# Altium project ECS.PrjPCB
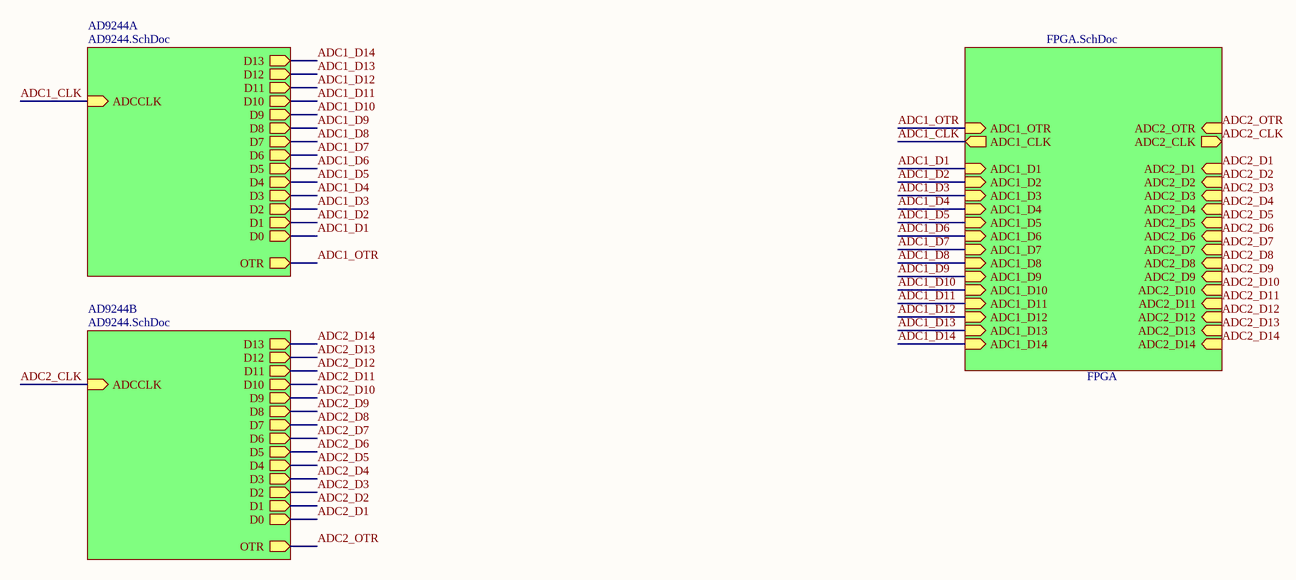
[diagram p0: ECS.SchDoc]
3 sheets, 237 parts. Net scope: hierarchical (ports join the sheet entries above them; power ports are global).
Board file: ECS.PcbDoc
Sheets:
  ECS.SchDoc
    FPGA = FPGA.SchDoc
    AD9244A = AD9244.SchDoc
    AD9244B = AD9244.SchDoc

## Sheet ECS.SchDoc
size A4

### Sub-sheets
AD9244A = AD9244.SchDoc: D13 (out), D12 (out), D11 (out), D10 (out), D9 (out), D8 (out), D7 (out), D6 (out), D4 (out), D5 (out), D3 (out), D2 (out), D1 (out), D0 (out), OTR (out), ADCCLK (in)
AD9244B = AD9244.SchDoc: D13 (out), D12 (out), D11 (out), D10 (out), D9 (out), D8 (out), D7 (out), D6 (out), D4 (out), D5 (out), D3 (out), D2 (out), D1 (out), D0 (out), OTR (out), ADCCLK (in)
FPGA = FPGA.SchDoc: ADC1_OTR (in), ADC1_D1 (in), ADC1_D2 (in), ADC1_D3 (in), ADC1_D4 (in), ADC1_D5 (in), ADC1_D6 (in), ADC1_D7 (in), ADC1_D8 (in), ADC1_D9 (in), ADC1_D10 (in), ADC1_D11 (in), ADC1_D12 (in), ADC1_D13 (in), ADC1_D14 (in), ADC1_CLK (out), ADC2_CLK (out), ADC2_OTR (in), ADC2_D1 (in), ADC2_D2 (in), ADC2_D3 (in), ADC2_D4 (in), ADC2_D5 (in), ADC2_D6 (in), ADC2_D7 (in), ADC2_D8 (in), ADC2_D9 (in), ADC2_D10 (in), ADC2_D11 (in), ADC2_D12 (in), ADC2_D13 (in), ADC2_D14 (in)

### Nets
ADC1_CLK: sheet FPGA/ADC1_CLK, sheet AD9244A/ADCCLK
ADC1_D1: sheet FPGA/ADC1_D1, sheet AD9244A/D0
ADC1_D2: sheet FPGA/ADC1_D2, sheet AD9244A/D1
ADC1_D3: sheet FPGA/ADC1_D3, sheet AD9244A/D2
ADC1_D4: sheet FPGA/ADC1_D4, sheet AD9244A/D3
ADC1_D5: sheet FPGA/ADC1_D5, sheet AD9244A/D4
ADC1_D6: sheet FPGA/ADC1_D6, sheet AD9244A/D5
ADC1_D7: sheet FPGA/ADC1_D7, sheet AD9244A/D6
ADC1_D8: sheet FPGA/ADC1_D8, sheet AD9244A/D7
ADC1_D9: sheet FPGA/ADC1_D9, sheet AD9244A/D8
ADC1_D10: sheet FPGA/ADC1_D10, sheet AD9244A/D9
ADC1_D11: sheet FPGA/ADC1_D11, sheet AD9244A/D10
ADC1_D12: sheet FPGA/ADC1_D12, sheet AD9244A/D11
ADC1_D13: sheet FPGA/ADC1_D13, sheet AD9244A/D12
ADC1_D14: sheet FPGA/ADC1_D14, sheet AD9244A/D13
ADC1_OTR: sheet FPGA/ADC1_OTR, sheet AD9244A/OTR
ADC2_CLK: sheet FPGA/ADC2_CLK, sheet AD9244B/ADCCLK
ADC2_D1: sheet FPGA/ADC2_D1, sheet AD9244B/D0
ADC2_D2: sheet FPGA/ADC2_D2, sheet AD9244B/D1
ADC2_D3: sheet FPGA/ADC2_D3, sheet AD9244B/D2
ADC2_D4: sheet FPGA/ADC2_D4, sheet AD9244B/D3
ADC2_D5: sheet FPGA/ADC2_D5, sheet AD9244B/D4
ADC2_D6: sheet FPGA/ADC2_D6, sheet AD9244B/D5
ADC2_D7: sheet FPGA/ADC2_D7, sheet AD9244B/D6
ADC2_D8: sheet FPGA/ADC2_D8, sheet AD9244B/D7
ADC2_D9: sheet FPGA/ADC2_D9, sheet AD9244B/D8
ADC2_D10: sheet FPGA/ADC2_D10, sheet AD9244B/D9
ADC2_D11: sheet FPGA/ADC2_D11, sheet AD9244B/D10
ADC2_D12: sheet FPGA/ADC2_D12, sheet AD9244B/D11
ADC2_D13: sheet FPGA/ADC2_D13, sheet AD9244B/D12
ADC2_D14: sheet FPGA/ADC2_D14, sheet AD9244B/D13
ADC2_OTR: sheet FPGA/ADC2_OTR, sheet AD9244B/OTR

## Sheet FPGA.SchDoc
size A2
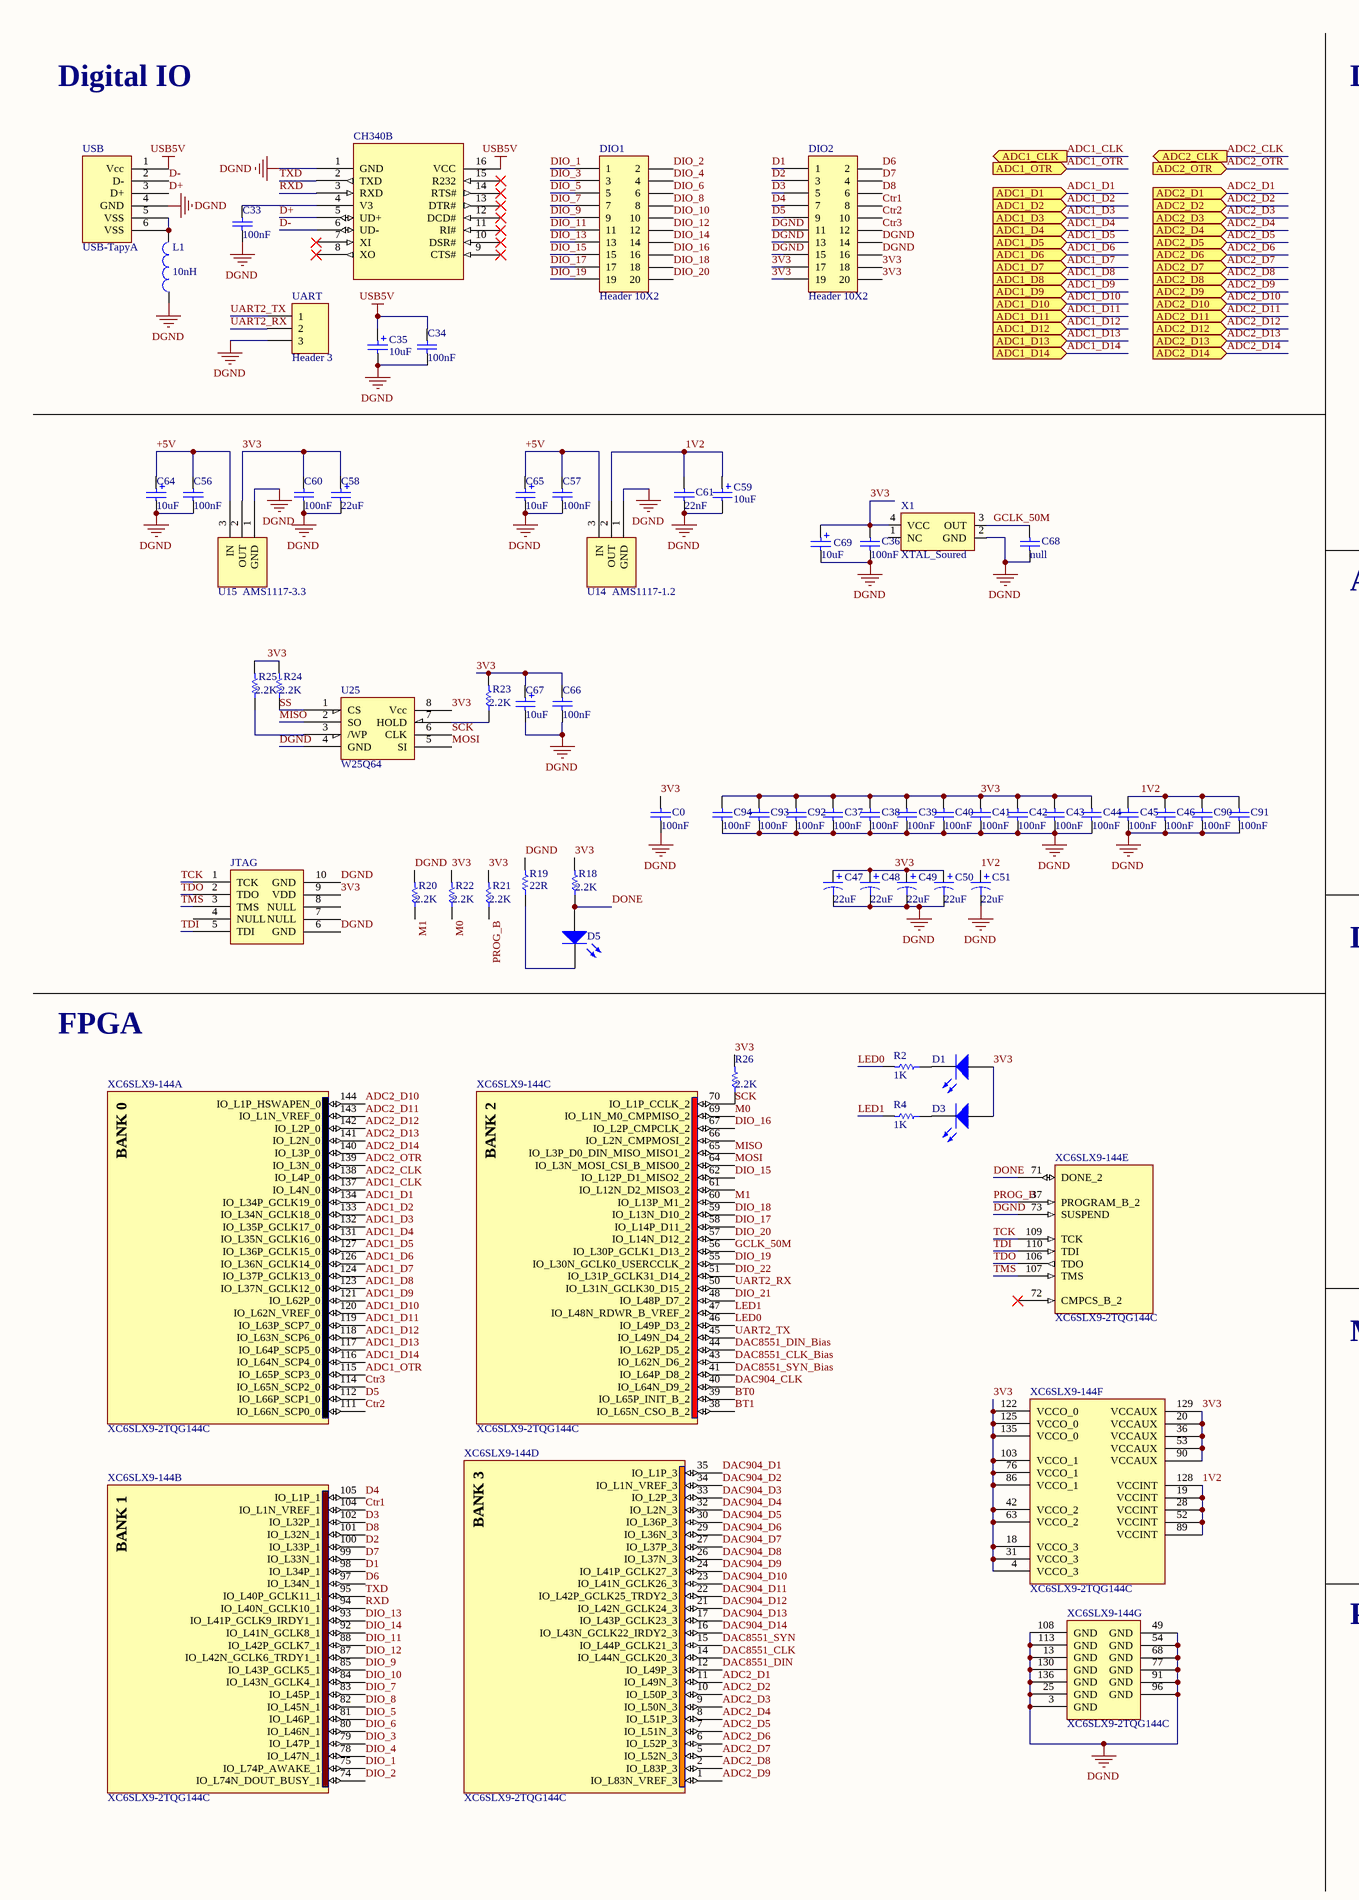
[diagram p1: FPGA.SchDoc, left]
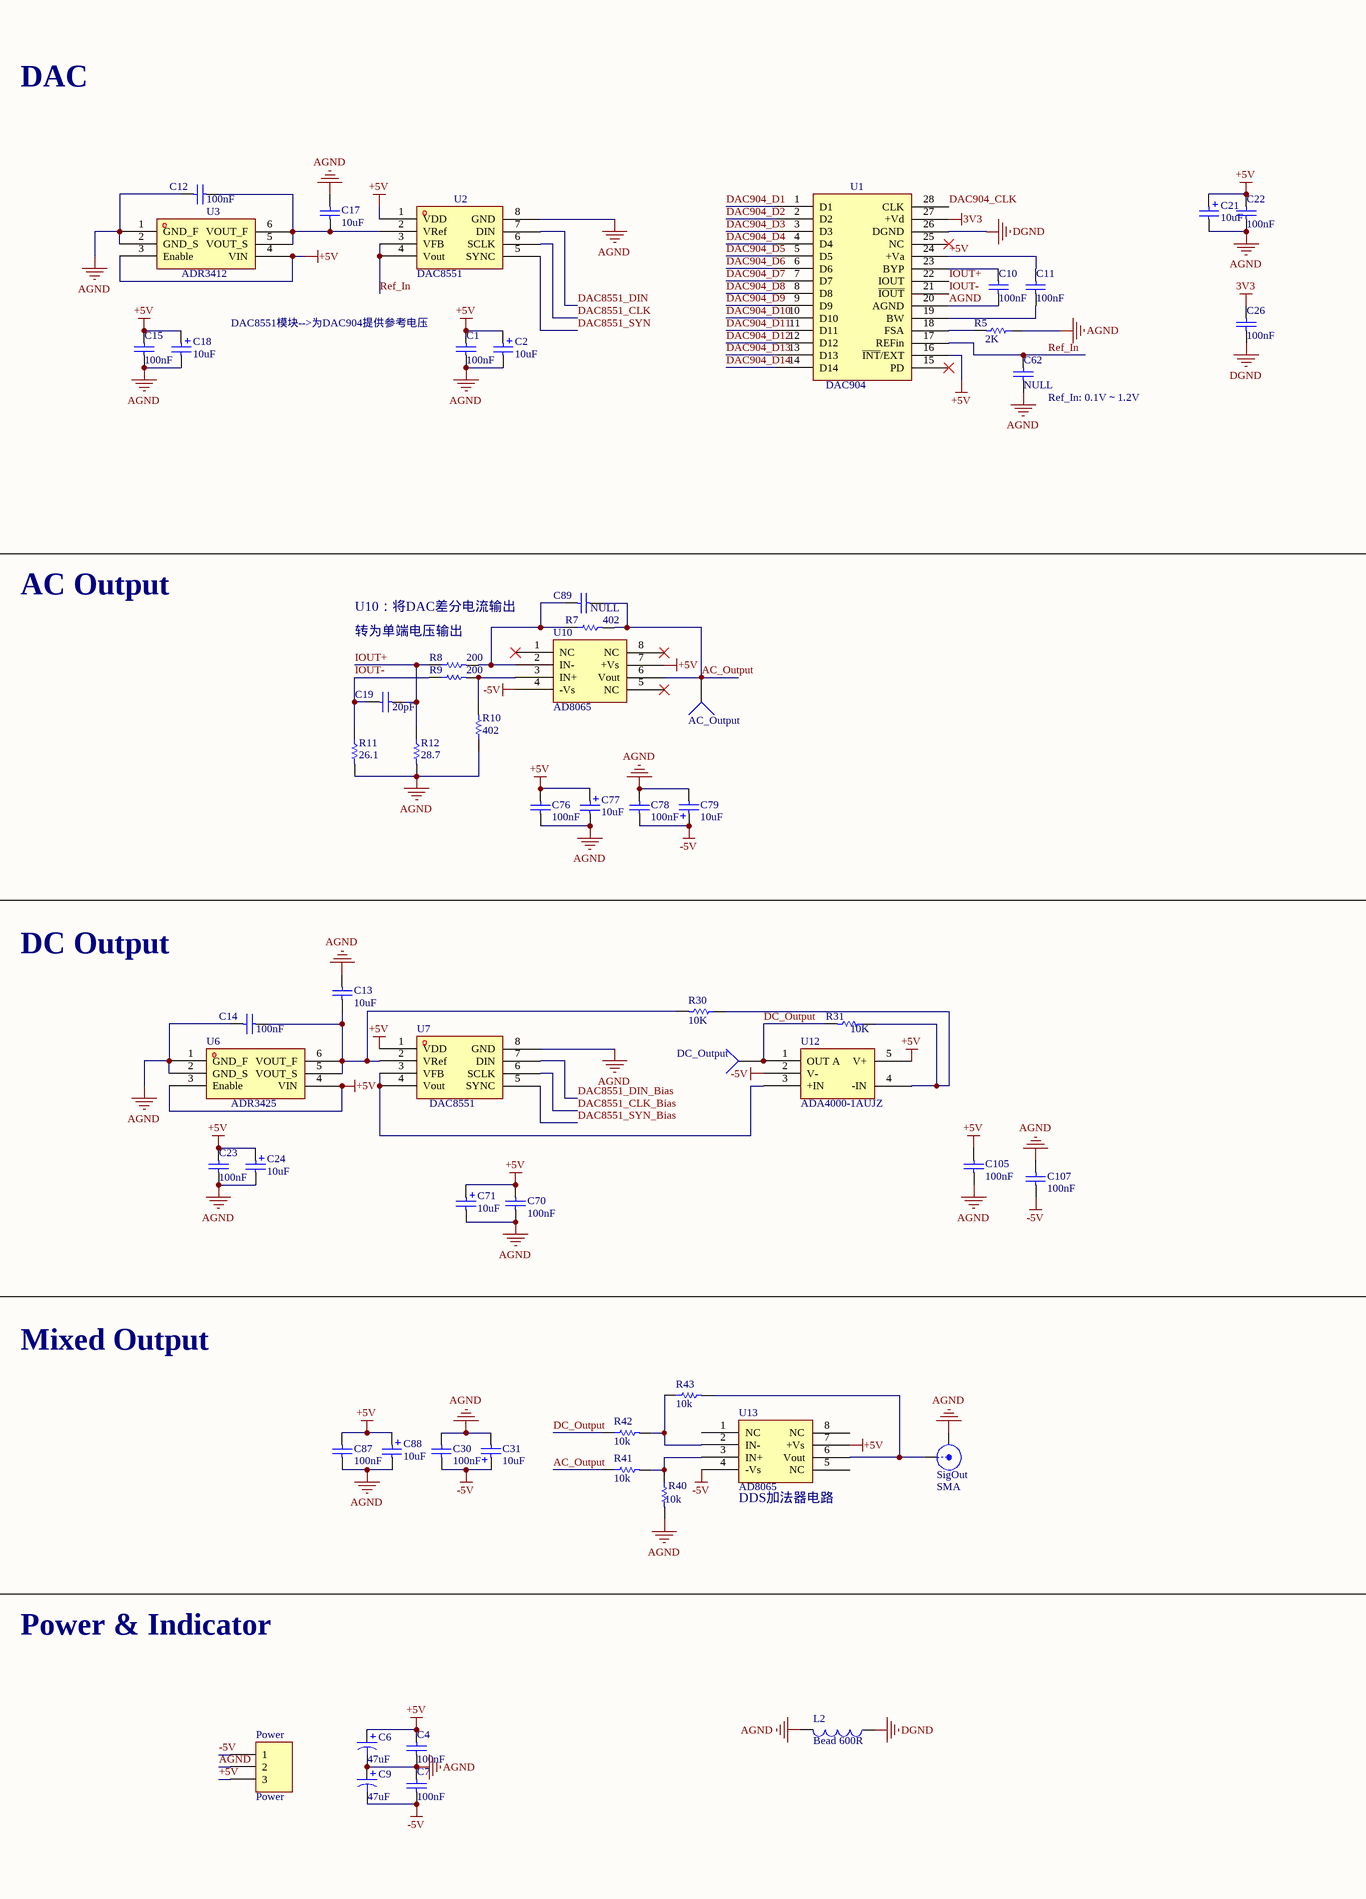
[diagram p2: FPGA.SchDoc, right]

### Parts
AC_Output  OutDir  [PIN1]  (value not drawn)
C0  100nF  [0603]
C1  100nF  [0603]
C2  10uF  [3216]
C4  100nF  [0603]
C6  47uF  [cap_pol_8*10.2]
C7  100nF  [0603]
C9  47uF  [cap_pol_8*10.2]
C10  100nF  [0603]
C11  100nF  [0603]
C12  100nF  [0603]
C13  10uF  [0805]
C14  100nF  [0603]
C15  100nF  [0603]
C17  value 10uF  [0805]  (hidden comment: 100nF)
C18  10uF  [3216]
C19  20pF  [0603]
C21  10uF  [3216]
C22  100nF  [0603]
C23  100nF  [0603]
C24  10uF  [3216]
C26  100nF  [0603]
C30  100nF  [0603]
C31  10uF  [3216]
C33  100nF  [0603]
C34  100nF  [0603]
C35  10uF  [3216]
C36  100nF  [0603]
C37  100nF  [0603]
C38  100nF  [0603]
C39  100nF  [0603]
C40  100nF  [0603]
C41  100nF  [0603]
C42  100nF  [0603]
C43  100nF  [0603]
C44  100nF  [0603]
C45  100nF  [0603]
C46  100nF  [0603]
C47  22uF  [3216]
C48  22uF  [3216]
C49  22uF  [3216]
C50  22uF  [3216]
C51  22uF  [3216]
C56  100nF  [0603]
C57  100nF  [0603]
C58  value 22uF  [3216]  (hidden comment: 10uF)
C59  10uF  [3216]
C60  100nF  [0603]
C61  22nF  [0603]
C62  value NULL  [0603]  (hidden comment: 100nF)
C64  10uF  [3216]
C65  10uF  [3216]
C66  100nF  [0603]
C67  10uF  [3216]
C68  value null  [0603]  (hidden comment: 100nF)
C69  10uF  [3216]
C70  100nF  [0603]
C71  10uF  [3216]
C76  100nF  [0603]
C77  10uF  [3216]
C78  100nF  [0603]
C79  10uF  [3216]
C87  100nF  [0603]
C88  10uF  [3216]
C89  NULL  [0603]
C90  100nF  [0603]
C91  100nF  [0603]
C92  100nF  [0603]
C93  100nF  [0603]
C94  100nF  [0603]
C105  100nF  [0603]
C107  100nF  [0603]
CH340B  Comment  [PCBComponent_1]  (value not drawn)
D1  LED3  [1206_LED]  (value not drawn)
D3  LED3  [1206_LED]  (value not drawn)
D5  LED3  [0805_pol1]  (value not drawn)
DC_Output  OutDir  [PIN1]  (value not drawn)
DIO1  Header 10X2  [HDR2X10]
DIO2  Header 10X2  [HDR2X10]
JTAG  JTAG 2*5p 2.00mm 180 degree  [JTAG_2.54_2x5]  (value not drawn)
L1  10nH  [0805]
L2  value Bead 600R  [0805]  (hidden comment: 10nH)
Power  Power  [PWR_3T]
R2  value 1K  [0603]  (hidden comment: 2.2K)
R4  value 1K  [0603]  (hidden comment: 2.2K)
R5  value 2K  [0603]  (hidden comment: 4.7K)
R7  402  [0603]
R8  200  [0603]
R9  200  [0603]
R10  402  [0603]
R11  26.1  [0603]
R12  28.7  [0603]
R18  2.2K  [0603]
R19  22R  [0603]
R20  2.2K  [0603]
R21  2.2K  [0603]
R22  2.2K  [0603]
R23  2.2K  [0603]
R24  2.2K  [0603]
R25  2.2K  [0603]
R26  2.2K  [0603]
R30  10K  [0603]
R31  10K  [0603]
R40  10k  [0603]
R41  10k  [0603]
R42  10k  [0603]
R43  10k  [0603]
SigOut  SMA  [SMA_SMT]
U1  DAC904  [TSSOP-28]
U2  DAC8551  [VSSOP-8]
U3  ADR3412  [SOT23-6]
U6  ADR3425  [SOT23-6]
U7  DAC8551  [VSSOP-8]
U10  AD8065  [SO-8N]
U12  ADA4000-1AUJZ  [SOT-23-5]
U13  AD8065  [SO-8N]
U14  AMS1117-1.2  [SOT-223]
U15  AMS1117-3.3  [SOT-223]
U25  W25Q64  [SO-8M]
UART  Header 3  [HDR1X3]
USB  USB-TapyA
X1  XTAL_Soured  [XTAL3225]
XC6SLX9-144  XC6SLX9-2TQG144C  [TQG144_N]  (parts A,B,C,D,E,F,G of 7)

### Ports
ADC1_CLK (out), ADC1_D1 (in), ADC1_D2 (in), ADC1_D3 (in), ADC1_D4 (in), ADC1_D5 (in), ADC1_D6 (in), ADC1_D7 (in), ADC1_D8 (in), ADC1_D9 (in), ADC1_D10 (in), ADC1_D11 (in), ADC1_D12 (in), ADC1_D13 (in), ADC1_D14 (in), ADC1_OTR (in), ADC2_CLK (out), ADC2_D1 (in), ADC2_D2 (in), ADC2_D3 (in), ADC2_D4 (in), ADC2_D5 (in), ADC2_D6 (in), ADC2_D7 (in), ADC2_D8 (in), ADC2_D9 (in), ADC2_D10 (in), ADC2_D11 (in), ADC2_D12 (in), ADC2_D13 (in), ADC2_D14 (in), ADC2_OTR (in)

### Nets
3V3: C0.2 C26.1 C36.2 C37.2 C38.2 C39.2 C40.2 C41.2 C42.2 C43.2 C44.2 C47.1 C48.1 C49.1 C50.1 C58.1 C60.2 C66.2 C67.1 C69.1 C92.2 C93.2 C94.2 D1.1(A) D3.1(A) DIO2.17 DIO2.18 DIO2.19 DIO2.20 JTAG.9(VDD) R18.2 R21.2 R22.2 R23.2 R24.2 R25.2 R26.2 U1.27(+Vd) U15.2(OUT) U25.8(Vcc) X1.4(VCC) XC6SLX9-144.4(VCCO_3) XC6SLX9-144.18(VCCO_3) XC6SLX9-144.20(VCCAUX) XC6SLX9-144.31(VCCO_3) XC6SLX9-144.36(VCCAUX) XC6SLX9-144.42(VCCO_2) XC6SLX9-144.53(VCCAUX) XC6SLX9-144.63(VCCO_2) XC6SLX9-144.76(VCCO_1) XC6SLX9-144.86(VCCO_1) XC6SLX9-144.90(VCCAUX) XC6SLX9-144.103(VCCO_1) XC6SLX9-144.122(VCCO_0) XC6SLX9-144.125(VCCO_0) XC6SLX9-144.129(VCCAUX) XC6SLX9-144.135(VCCO_0)
+5V: C1.2 C2.1 C4.1 C6.1 C11.1 C15.1 C18.1 C21.1 C22.1 C23.1 C24.1 C56.2 C57.2 C64.1 C65.1 C70.1 C71.1 C76.2 C77.1 C87.2 C88.1 C105.2 Power.3 U1.16(~{INT}/EXT) U1.24(+Va) U2.1(VDD) U3.3(Enable) U3.4(VIN) U6.3(Enable) U6.4(VIN) U7.1(VDD) U10.7(+Vs) U12.5(V+) U13.7(+Vs) U14.3(IN) U15.3(IN)
-5V: C7.2 C9.2 C30.1 C31.1 C78.1 C79.1 C107.1 Power.1 U10.4(-Vs) U12.2(V-) U13.4(-Vs)
AGND: C1.1 C2.2 C4.2 C6.2 C7.1 C9.1 C10.2 C12.1 C13.2 C14.1 C15.2 C17.2 C18.2 C21.2 C22.2 C23.2 C24.2 C30.2 C31.2 C62.2 C70.2 C71.2 C76.1 C77.2 C78.2 C79.2 C87.1 C88.2 C105.1 C107.2 L2.2 Power.2 R5.1 R10.1 R11.2 R12.2 R40.2 SigOut.2(Y) U1.20(AGND) U2.8(GND) U3.1(GND_F) U3.2(GND_S) U6.1(GND_F) U6.2(GND_S) U7.8(GND)
DGND: C0.1 C26.2 C33.2 C34.2 C35.2 C36.1 C37.1 C38.1 C39.1 C40.1 C41.1 C42.1 C43.1 C44.1 C45.1 C46.1 C47.2 C48.2 C49.2 C50.2 C51.2 C56.1 C57.1 C58.2 C59.2 C60.1 C61.1 C64.2 C65.2 C66.1 C67.2 C68.1 C69.2 C90.1 C91.1 C92.1 C93.1 C94.1 CH340B.1(GND) DIO2.11 DIO2.13 DIO2.14 DIO2.15 DIO2.16 JTAG.6(GND) JTAG.10(GND) L1.1 L2.1 R19.2 R20.2 U1.26(DGND) U14.1(GND) U15.1(GND) U25.4(GND) UART.3 USB.4(GND) X1.2(GND) XC6SLX9-144.3(GND) XC6SLX9-144.13(GND) XC6SLX9-144.25(GND) XC6SLX9-144.49(GND) XC6SLX9-144.54(GND) XC6SLX9-144.68(GND) XC6SLX9-144.73(SUSPEND) XC6SLX9-144.77(GND) XC6SLX9-144.91(GND) XC6SLX9-144.96(GND) XC6SLX9-144.108(GND) XC6SLX9-144.113(GND) XC6SLX9-144.130(GND) XC6SLX9-144.136(GND)
USB5V: C34.1 C35.1 CH340B.16(VCC) USB.1(Vcc)
1V2: C45.2 C46.2 C51.1 C59.1 C61.2 C90.2 C91.2 U14.2(OUT) XC6SLX9-144.19(VCCINT) XC6SLX9-144.28(VCCINT) XC6SLX9-144.52(VCCINT) XC6SLX9-144.89(VCCINT) XC6SLX9-144.128(VCCINT)
AC_Output: AC_Output.1 C89.2 R7.2 R41.1 U10.6(Vout)
ADC1_CLK: XC6SLX9-144.137(IO_L4N_0) ; port ADC1_CLK
ADC1_D1: XC6SLX9-144.134(IO_L34P_GCLK19_0) ; port ADC1_D1
ADC1_D2: XC6SLX9-144.133(IO_L34N_GCLK18_0) ; port ADC1_D2
ADC1_D3: XC6SLX9-144.132(IO_L35P_GCLK17_0) ; port ADC1_D3
ADC1_D4: XC6SLX9-144.131(IO_L35N_GCLK16_0) ; port ADC1_D4
ADC1_D5: XC6SLX9-144.127(IO_L36P_GCLK15_0) ; port ADC1_D5
ADC1_D6: XC6SLX9-144.126(IO_L36N_GCLK14_0) ; port ADC1_D6
ADC1_D7: XC6SLX9-144.124(IO_L37P_GCLK13_0) ; port ADC1_D7
ADC1_D8: XC6SLX9-144.123(IO_L37N_GCLK12_0) ; port ADC1_D8
ADC1_D9: XC6SLX9-144.121(IO_L62P_0) ; port ADC1_D9
ADC1_D10: XC6SLX9-144.120(IO_L62N_VREF_0) ; port ADC1_D10
ADC1_D11: XC6SLX9-144.119(IO_L63P_SCP7_0) ; port ADC1_D11
ADC1_D12: XC6SLX9-144.118(IO_L63N_SCP6_0) ; port ADC1_D12
ADC1_D13: XC6SLX9-144.117(IO_L64P_SCP5_0) ; port ADC1_D13
ADC1_D14: XC6SLX9-144.116(IO_L64N_SCP4_0) ; port ADC1_D14
ADC1_OTR: XC6SLX9-144.115(IO_L65P_SCP3_0) ; port ADC1_OTR
ADC2_CLK: XC6SLX9-144.138(IO_L4P_0) ; port ADC2_CLK
ADC2_D1: XC6SLX9-144.11(IO_L49N_3) ; port ADC2_D1
ADC2_D2: XC6SLX9-144.10(IO_L50P_3) ; port ADC2_D2
ADC2_D3: XC6SLX9-144.9(IO_L50N_3) ; port ADC2_D3
ADC2_D4: XC6SLX9-144.8(IO_L51P_3) ; port ADC2_D4
ADC2_D5: XC6SLX9-144.7(IO_L51N_3) ; port ADC2_D5
ADC2_D6: XC6SLX9-144.6(IO_L52P_3) ; port ADC2_D6
ADC2_D7: XC6SLX9-144.5(IO_L52N_3) ; port ADC2_D7
ADC2_D8: XC6SLX9-144.2(IO_L83P_3) ; port ADC2_D8
ADC2_D9: XC6SLX9-144.1(IO_L83N_VREF_3) ; port ADC2_D9
ADC2_D10: XC6SLX9-144.144(IO_L1P_HSWAPEN_0) ; port ADC2_D10
ADC2_D11: XC6SLX9-144.143(IO_L1N_VREF_0) ; port ADC2_D11
ADC2_D12: XC6SLX9-144.142(IO_L2P_0) ; port ADC2_D12
ADC2_D13: XC6SLX9-144.141(IO_L2N_0) ; port ADC2_D13
ADC2_D14: XC6SLX9-144.140(IO_L3P_0) ; port ADC2_D14
ADC2_OTR: XC6SLX9-144.139(IO_L3N_0) ; port ADC2_OTR
BT0: XC6SLX9-144.39(IO_L65P_INIT_B_2)
BT1: XC6SLX9-144.38(IO_L65N_CSO_B_2)
Ctr1: DIO2.8 XC6SLX9-144.104(IO_L1N_VREF_1)
Ctr2: DIO2.10 XC6SLX9-144.111(IO_L66N_SCP0_0)
Ctr3: DIO2.12 XC6SLX9-144.114(IO_L65N_SCP2_0)
D1: DIO2.1 XC6SLX9-144.98(IO_L34P_1)
D2: DIO2.3 XC6SLX9-144.100(IO_L33P_1)
D3: DIO2.5 XC6SLX9-144.102(IO_L32P_1)
D4: DIO2.7 XC6SLX9-144.105(IO_L1P_1)
D5: DIO2.9 XC6SLX9-144.112(IO_L66P_SCP1_0)
D6: DIO2.2 XC6SLX9-144.97(IO_L34N_1)
D7: DIO2.4 XC6SLX9-144.99(IO_L33N_1)
D8: DIO2.6 XC6SLX9-144.101(IO_L32N_1)
D+: CH340B.5(UD+) USB.3(D+)
D-: CH340B.6(UD-) USB.2(D-)
DAC904_CLK: U1.28(CLK) XC6SLX9-144.40(IO_L64N_D9_2)
DAC904_D1: U1.1(D1) XC6SLX9-144.35(IO_L1P_3)
DAC904_D2: U1.2(D2) XC6SLX9-144.34(IO_L1N_VREF_3)
DAC904_D3: U1.3(D3) XC6SLX9-144.33(IO_L2P_3)
DAC904_D4: U1.4(D4) XC6SLX9-144.32(IO_L2N_3)
DAC904_D5: U1.5(D5) XC6SLX9-144.30(IO_L36P_3)
DAC904_D6: U1.6(D6) XC6SLX9-144.29(IO_L36N_3)
DAC904_D7: U1.7(D7) XC6SLX9-144.27(IO_L37P_3)
DAC904_D8: U1.8(D8) XC6SLX9-144.26(IO_L37N_3)
DAC904_D9: U1.9(D9) XC6SLX9-144.24(IO_L41P_GCLK27_3)
DAC904_D10: U1.10(D10) XC6SLX9-144.23(IO_L41N_GCLK26_3)
DAC904_D11: U1.11(D11) XC6SLX9-144.22(IO_L42P_GCLK25_TRDY2_3)
DAC904_D12: U1.12(D12) XC6SLX9-144.21(IO_L42N_GCLK24_3)
DAC904_D13: U1.13(D13) XC6SLX9-144.17(IO_L43P_GCLK23_3)
DAC904_D14: U1.14(D14) XC6SLX9-144.16(IO_L43N_GCLK22_IRDY2_3)
DAC8551_CLK: U2.6(SCLK) XC6SLX9-144.14(IO_L44N_GCLK20_3)
DAC8551_CLK_Bias: U7.6(SCLK) XC6SLX9-144.43(IO_L62N_D6_2)
DAC8551_DIN: U2.7(DIN) XC6SLX9-144.12(IO_L49P_3)
DAC8551_DIN_Bias: U7.7(DIN) XC6SLX9-144.44(IO_L62P_D5_2)
DAC8551_SYN: U2.5(SYNC) XC6SLX9-144.15(IO_L44P_GCLK21_3)
DAC8551_SYN_Bias: U7.5(SYNC) XC6SLX9-144.41(IO_L64P_D8_2)
DC_Output: DC_Output.1 R31.2 R42.1 U12.1(OUT_A)
DIO_1: DIO1.1 XC6SLX9-144.75(IO_L74P_AWAKE_1)
DIO_2: DIO1.2 XC6SLX9-144.74(IO_L74N_DOUT_BUSY_1)
DIO_3: DIO1.3 XC6SLX9-144.79(IO_L47P_1)
DIO_4: DIO1.4 XC6SLX9-144.78(IO_L47N_1)
DIO_5: DIO1.5 XC6SLX9-144.81(IO_L46P_1)
DIO_6: DIO1.6 XC6SLX9-144.80(IO_L46N_1)
DIO_7: DIO1.7 XC6SLX9-144.83(IO_L45P_1)
DIO_8: DIO1.8 XC6SLX9-144.82(IO_L45N_1)
DIO_9: DIO1.9 XC6SLX9-144.85(IO_L43P_GCLK5_1)
DIO_10: DIO1.10 XC6SLX9-144.84(IO_L43N_GCLK4_1)
DIO_11: DIO1.11 XC6SLX9-144.88(IO_L42P_GCLK7_1)
DIO_12: DIO1.12 XC6SLX9-144.87(IO_L42N_GCLK6_TRDY1_1)
DIO_13: DIO1.13 XC6SLX9-144.93(IO_L41P_GCLK9_IRDY1_1)
DIO_14: DIO1.14 XC6SLX9-144.92(IO_L41N_GCLK8_1)
DIO_15: DIO1.15 XC6SLX9-144.62(IO_L12P_D1_MISO2_2)
DIO_16: DIO1.16 XC6SLX9-144.67(IO_L2P_CMPCLK_2)
DIO_17: DIO1.17 XC6SLX9-144.58(IO_L14P_D11_2)
DIO_18: DIO1.18 XC6SLX9-144.59(IO_L13N_D10_2)
DIO_19: DIO1.19 XC6SLX9-144.55(IO_L30N_GCLK0_USERCCLK_2)
DIO_20: DIO1.20 XC6SLX9-144.57(IO_L14N_D12_2)
DIO_21: XC6SLX9-144.48(IO_L48P_D7_2)
DIO_22: XC6SLX9-144.51(IO_L31P_GCLK31_D14_2)
DONE: D5.1(A) R18.1 XC6SLX9-144.71(DONE_2)
GCLK_50M: C68.2 X1.3(OUT) XC6SLX9-144.56(IO_L30P_GCLK1_D13_2)
IOUT+: C19.2 R8.1 R12.1 U1.22(IOUT)
IOUT-: C19.1 R9.1 R11.1 U1.21(~{IOUT})
LED0: R2.2 XC6SLX9-144.46(IO_L49P_D3_2)
LED1: R4.2 XC6SLX9-144.47(IO_L48N_RDWR_B_VREF_2)
M0: R22.1 XC6SLX9-144.69(IO_L1N_M0_CMPMISO_2)
M1: R20.1 XC6SLX9-144.60(IO_L13P_M1_2)
MISO: U25.2(SO) XC6SLX9-144.65(IO_L3P_D0_DIN_MISO_MISO1_2)
MOSI: U25.5(SI) XC6SLX9-144.64(IO_L3N_MOSI_CSI_B_MISO0_2)
PROG_B: R21.1 XC6SLX9-144.37(PROGRAM_B_2)
Ref_In: C62.1 U1.17(REFin) U2.3(VFB) U2.4(Vout)
RXD: CH340B.3(RXD) XC6SLX9-144.94(IO_L40N_GCLK10_1)
SCK: R26.1 U25.6(CLK) XC6SLX9-144.70(IO_L1P_CCLK_2)
SS: R24.1 U25.1(CS)
TCK: JTAG.1(TCK) XC6SLX9-144.109(TCK)
TDI: JTAG.5(TDI) XC6SLX9-144.110(TDI)
TDO: JTAG.2(TDO) XC6SLX9-144.106(TDO)
TMS: JTAG.3(TMS) XC6SLX9-144.107(TMS)
TXD: CH340B.2(TXD) XC6SLX9-144.95(IO_L40P_GCLK11_1)
UART2_RX: UART.2 XC6SLX9-144.50(IO_L31N_GCLK30_D15_2)
UART2_TX: UART.1 XC6SLX9-144.45(IO_L49N_D4_2)
NetC10_1: C10.1 U1.23(BYP)
NetC11_2: C11.2 U1.19(BW)
NetC12_2: C12.2 C17.1 U2.2(VRef) U3.5(VOUT_S) U3.6(VOUT_F)
NetC13_1: C13.1 C14.2 R30.2 U6.5(VOUT_S) U6.6(VOUT_F) U7.2(VRef)
NetC33_1: C33.1 CH340B.4(V3)
NetC89_1: C89.1 R7.1 R8.2 U10.2(IN-)
NetD1_2: D1.2(K) R2.1
NetD3_2: D3.2(K) R4.1
NetD5_2: D5.2(K) R19.1
NetL1_2: L1.2 USB.5(VSS) USB.6(VSS)
NetR5_2: R5.2 U1.18(FSA)
NetR9_2: R9.2 R10.2 U10.3(IN+)
NetR23_1: R23.1 U25.7(HOLD)
NetR25_1: R25.1 U25.3(/WP)
NetR30_1: R30.1 R31.1 U12.4(-IN)
NetR40_1: R40.1 R41.2 U13.3(IN+)
NetR42_2: R42.2 R43.1 U13.2(IN-)
NetR43_2: R43.2 SigOut.1(X) U13.6(Vout)
NetU7_3: U7.3(VFB) U7.4(Vout) U12.3(+IN)

Not connected (* = marked no-connect by the designer): CH340B 7(XI)* 8(XO)* 9(CTS#)* 10(DSR#)* 11(RI#)* 12(DCD#)* 13(DTR#)* 14(RTS#)* 15(R232)*; JTAG 4(NULL) 7(NULL) 8(NULL); U1 15(PD)* 25(NC)*; U10 1(NC)* 5(NC)* 8(NC)*; U13 1(NC) 5(NC) 8(NC); X1 1(NC); XC6SLX9-144 61(IO_L12N_D2_MISO3_2) 66(IO_L2N_CMPMOSI_2) 72(CMPCS_B_2)*

### Notes on the sheet
- Digital IO
- DAC
- DAC8551模块-->为DAC904提供参考电压
- (near C62) Ref_In: 0.1V～1.2V
- AC Output
- U10：将DAC差分电流输出
- 转为单端电压输出
- DC Output
- FPGA
- Mixed Output
- (near U13) DDS加法器电路
- Power & Indicator
- (in symbol XC6SLX9-2TQG144C, part A) BANK 0
- (in symbol XC6SLX9-2TQG144C, part B) BANK 1
- (in symbol XC6SLX9-2TQG144C, part C) BANK 2
- (in symbol XC6SLX9-2TQG144C, part D) BANK 3

### Library data of the parts
AC_Output DC_Output = Socket: LatestRevisionDate: 17-Jul-2002; LatestRevisionNote: Re-released for DXP Platform.; Publisher: Altium Limited
C0 C36-C46 C56 C57 C60 C61 C66 C68 C90-C94 = Cap: Capacitor; Published: 8-Jun-2000; LatestRevisionDate: 17-Jul-2002; LatestRevisionNote: Re-released for DXP Platform.; PackageReference: RAD-0.3; Publisher: Altium Limited
  C0 C36-C46 C56 C57 C60 C66 C90-C94: Value: 100nF
  C61: Value: 22nF
C1 C4 C7 C10-C15 C17 C22 C23 C26 C30 C33 C34 C62 C70 C76 C78 C87 C105 C107 = Cap Semi: Capacitor (Semiconductor SIM Model); Published: 8-Jun-2000; LatestRevisionDate: 29-May-2009; LatestRevisionNote: IPC-7351 Footprint Added.; PackageReference: C1206; Publisher: Altium Limited; PackageDescription: Chip Capacitor
  C1 C4 C7 C10-C12 C14 C15 C22 C23 C26 C30 C33 C34 C70 C76 C78 C87 C105 C107: Value: 100nF
  C13: Value: 10uF
C2 C18 C21 C24 C31 C35 C58 C59 C64 C65 C67 C69 C71 C77 C79 C88 = Cap Pol2: Polarized Capacitor (Axial); Published: 8-Jun-2000; LatestRevisionDate: 17-Jul-2002; LatestRevisionNote: Re-released for DXP Platform.; PackageReference: POLAR0.8; Publisher: Altium Limited
  C2 C18 C21 C24 C31 C35 C59 C64 C65 C67 C69 C71 C77 C79 C88: Value: 10uF
C6 C9 C47-C51 = Cap Pol3: Polarized Capacitor (Surface Mount); Published: 8-Jun-2000; LatestRevisionDate: 29-May-2009; LatestRevisionNote: IPC-7351 Footprint Added.; PackageReference: C0805; Publisher: Altium Limited; PackageDescription: Chip Capacitor
  C6 C9: Value: 47uF
  C47-C51: Value: 22uF
C19 C89 = Cap Semi: Capacitor (Semiconductor SIM Model); Value: 100nF; Published: 8-Jun-2000; LatestRevisionDate: 29-May-2009; LatestRevisionNote: IPC-7351 Footprint Added.; PackageReference: C1206; Publisher: Altium Limited; PackageDescription: Chip Capacitor
CH340B = CH340G: USB to TTL Serial / UART
D1 D3 D5 = LED3: Typical BLUE SiC LED; Published: 8-Jun-2000; LatestRevisionDate: 17-Dec-2003; LatestRevisionNote: PCB Footprint replaced.; DatasheetVersion: 16-Apr-2002; PackageVersion: 16-Apr-2002; PackageReference: 3.5X2.8X1.9; Publisher: Altium Limited
DIO1 DIO2 = Header 10X2: Header, 10-Pin, Dual row; LatestRevisionDate: 17-Jul-2002; LatestRevisionNote: Re-released for DXP Platform.; Publisher: Altium Limited
JTAG = FPGA_JTAG
L1 L2 = Inductor: Code_IEC: 1005; Published: 8-Jun-2000; LatestRevisionDate: 29-May-2009; LatestRevisionNote: IPC-7351 Footprint Added.; PackageReference: 0402-A; Publisher: Altium Limited; PackageDescription: Chip Inductor; Code_JEITA: 0402
  L1: Value: 10nH
Power UART = Header 3: Header, 3-Pin; LatestRevisionDate: 17-Jul-2002; LatestRevisionNote: Re-released for DXP Platform.; Publisher: Altium Limited
R2 R4 R5 R18 R20-R26 R30 R31 R40-R43 = Res1: Resistor; Published: 8-Jun-2000; LatestRevisionDate: 17-Jul-2002; LatestRevisionNote: Re-released for DXP Platform.; PackageReference: AXIAL-0.3; Publisher: Altium Limited
  R18 R20-R26: Value: 2.2K
  R30 R31: Value: 10K
  R40-R43: Value: 10k
R7-R12 = Res1: Resistor; Value: 2.2K; Published: 8-Jun-2000; LatestRevisionDate: 17-Jul-2002; LatestRevisionNote: Re-released for DXP Platform.; PackageReference: AXIAL-0.3; Publisher: Altium Limited
R19 = Res1: Resistor; Value: 22; Published: 8-Jun-2000; LatestRevisionDate: 17-Jul-2002; LatestRevisionNote: Re-released for DXP Platform.; PackageReference: AXIAL-0.3; Publisher: Altium Limited
SigOut = BNC: BNC Elbow Connector; LatestRevisionDate: 17-Jul-2002; LatestRevisionNote: Re-released for DXP Platform.; Publisher: Altium Limited
U1 = DAC90X: Footprint: TSSOP28
U2 U7 = AD5680
U3 U6 = ADR34xx
U10 U13 = AD8065: High Speed JFET Input Amplifier
U12 = AD8601: Precision CMOS, Single Supply, Rail to Rail, Windband Operational Amplifiers
U14 U15 = AMS1117
U25 = W25X16
XC6SLX9-144 = XC6SLX9-2TQG144C: Spartan-6 LX 1.2V FPGA, 102 User I/Os, 144-Pin TQFP (0.5mm Pitch), Speed Grade 2, Commercial Grade, Pb-Free; FirstPublished: 17-Nov-2009; DatasheetVersion: ver1.3, Nov-2009; PackageVersion: ver1.2, Jun-2004; PackageReference: TQG144; Publisher: Altium Limited; PackageDescription: 144-Pin Thin Quad Flat Pack (TQG144) - Pb-Free; Code_JEDEC: MS-026-BFB; ComponentLink1Description: Spartan-6 Datasheet; ComponentLink1URL: http://www.xilinx.com/support/documentation/data_sheets/ds160.pdf; ComponentLink2Description: Pinout Specification; ComponentLink2URL: http://www.xilinx.com/support/documentation/user_guides/ug385.pdf; ComponentLink3Description: TQG144 Package Drawing; ComponentLink3URL: http://www.xilinx.com/support/documentation/package_specs/tq144.pdf; ComponentLink4Description: Spartan-6 Documents; ComponentLink4URL: http://www.xilinx.com/support/documentation/spartan-6.htm; ComponentLink5Description: Xilinx.com Home; ComponentLink5URL: http://www.xilinx.com

## Sheet AD9244.SchDoc
size A4
Used 2 times, as channels AD9244A, AD9244B. Parts and nets are listed once, with the designators drawn on the sheet.
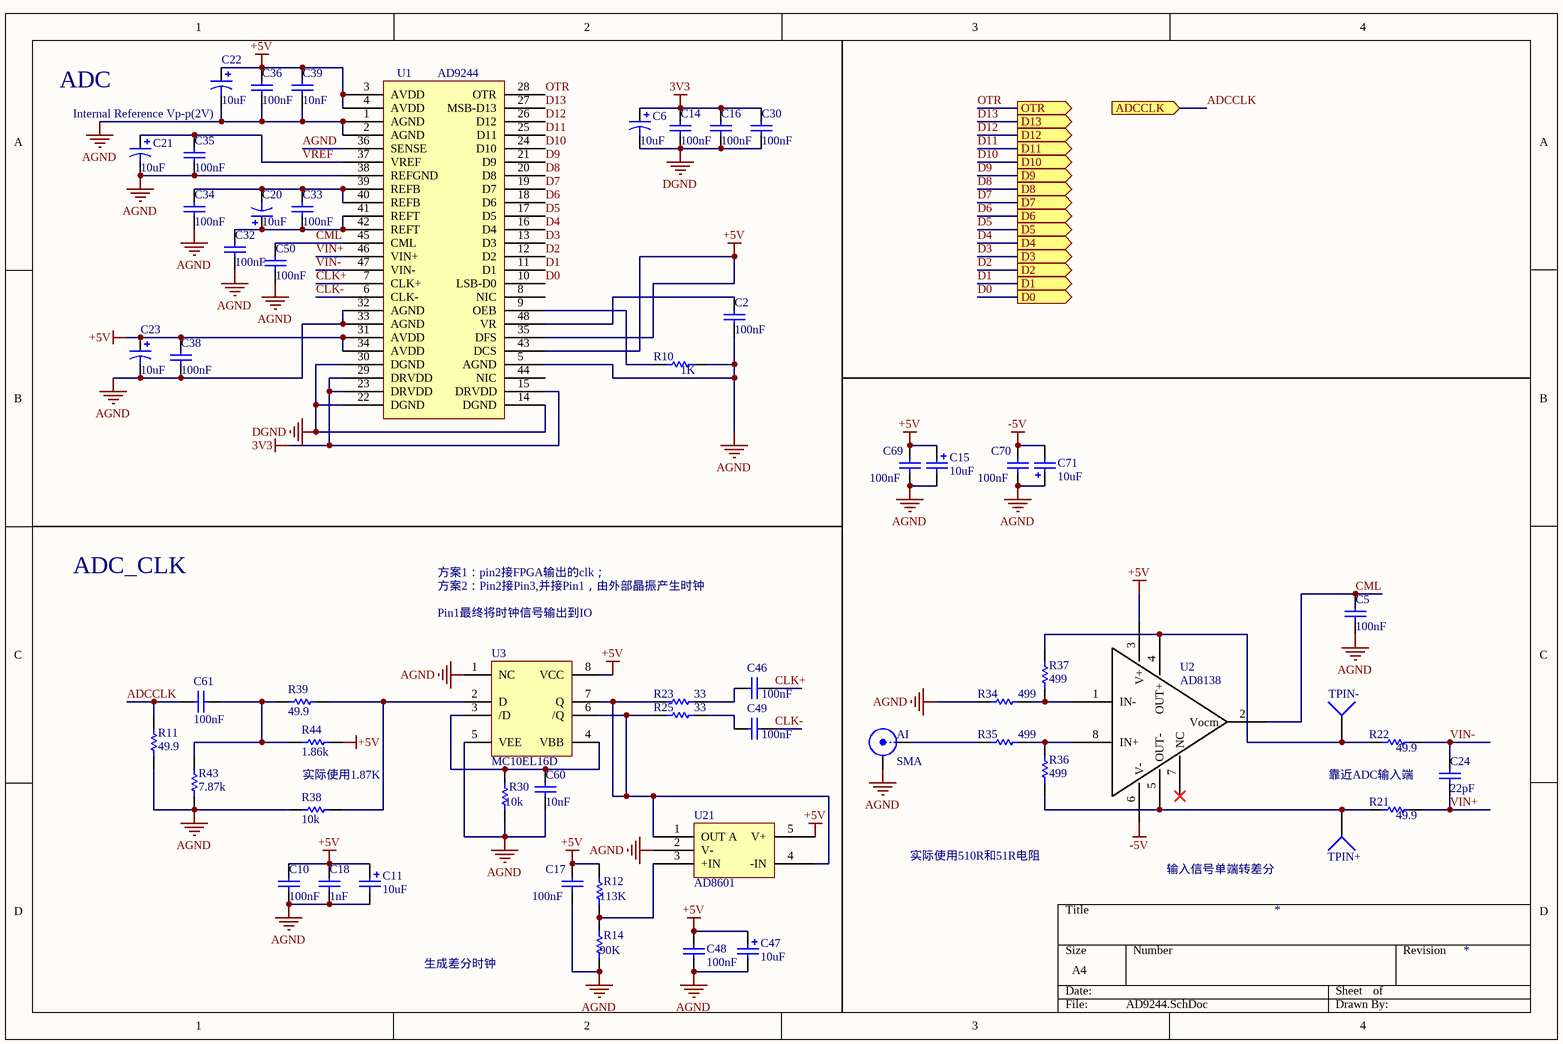
[diagram p3: AD9244.SchDoc]

### Parts
AI  SMA  [SMA_SMT]
C2  100nF  [0603]
C5  100nF  [0603]
C6  value 10uF  [1206]  (hidden comment: 10uF_pol)
C10  100nF  [0603]
C11  10uF  [3216]
C14  100nF  [0603]
C15  10uF  [3216]
C16  100nF  [0603]
C17  100nF  [0603]
C18  1nF  [0603]
C20  value 10uF  [1206]  (hidden comment: 10uF_pol)
C21  value 10uF  [1206]  (hidden comment: 10uF_pol)
C22  value 10uF  [1206]  (hidden comment: 10uF_pol)
C23  value 10uF  [1206]  (hidden comment: 10uF_pol)
C24  22pF  [0603]
C30  100nF  [0603]
C32  100nF  [0603]
C33  100nF  [0603]
C34  100nF  [0603]
C35  100nF  [0603]
C36  100nF  [0603]
C38  100nF  [0603]
C39  value 10nF  [0603]  (hidden comment: 100nF)
C46  100nF  [0603]
C47  10uF  [3216]
C48  100nF  [0603]
C49  100nF  [0603]
C50  100nF  [0603]
C60  10nF  [0603]
C61  100nF  [0603]
C69  100nF  [0603]
C70  100nF  [0603]
C71  10uF  [3216]
R10  1k  [0603]
R11  49.9  [0603]
R12  113K  [0603]
R14  90K  [0603]
R21  49.9  [0603]
R22  49.9  [0603]
R23  33  [0603]
R25  33  [0603]
R30  10k  [0603]
R34  499  [0603]
R35  499  [0603]
R36  499  [0603]
R37  499  [0603]
R38  10k  [0603]
R39  value 49.9  [0603]  (hidden comment: 49。9)
R43  7.87k  [0603]
R44  1.86k  [0603]
TPIN+  TPIN+  [PIN1]  (value not drawn)
TPIN-  TPIN-  [PIN1]  (value not drawn)
U1  AD9244
U2  AD8138  [SO-8N]
U3  MC10EL16D  [SO-8]
U21  AD8601  [SOT23-5]

### Ports
ADCCLK (in), D0 (out), D1 (out), D2 (out), D3 (out), D4 (out), D5 (out), D6 (out), D7 (out), D8 (out), D9 (out), D10 (out), D11 (out), D12 (out), D13 (out), OTR (out)

### Nets
3V3: C6.1 C14.1 C16.1 C30.1 U1.15(DRVDD) U1.23(DRVDD) U1.29(DRVDD)
+5V: C10.1 C11.1 C15.1 C17.1 C18.1 C22.1 C23.1 C36.1 C38.1 C39.1 C47.1 C48.2 C69.2 R12.1 R44.1 U1.3(AVDD) U1.4(AVDD) U1.31(AVDD) U1.34(AVDD) U1.35(DFS) U1.43(DCS) U2.3(V+) U3.8(VCC) U21.5(V+)
-5V: C70.2 C71.2 U2.6(V-)
AGND: AI.2(Y) C2.2 C5.2 C10.2 C11.2 C15.2 C17.2 C18.2 C21.2 C22.2 C23.2 C32.2 C34.2 C35.2 C36.2 C38.2 C39.2 C47.2 C48.1 C50.2 C60.2 C69.1 C70.1 C71.1 R10.1 R11.1 R14.2 R30.2 R34.1 R38.2 R43.1 U1.1(AGND) U1.2(AGND) U1.5(AGND) U1.32(AGND) U1.33(AGND) U1.36(SENSE) U1.38(REFGND) U3.1(NC) U3.5(VEE) U21.2(V-)
DGND: C6.2 C14.2 C16.2 C30.2 U1.14(DGND) U1.22(DGND) U1.30(DGND)
ADCCLK: C61.1 R11.2 ; port ADCCLK
CLK+: C46.2 U1.7(CLK+)
CLK-: C49.2 U1.6(CLK-)
CML: C5.1 C50.1 U1.45(CML) U2.2(Vocm)
D0: U1.10(LSB-D0) ; port D0
D1: U1.11(D1) ; port D1
D2: U1.12(D2) ; port D2
D3: U1.13(D3) ; port D3
D4: U1.16(D4) ; port D4
D5: U1.17(D5) ; port D5
D6: U1.18(D6) ; port D6
D7: U1.19(D7) ; port D7
D8: U1.20(D8) ; port D8
D9: U1.21(D9) ; port D9
D10: U1.24(D10) ; port D10
D11: U1.25(D11) ; port D11
D12: U1.26(D12) ; port D12
D13: U1.27(MSB-D13) ; port D13
OTR: U1.28(OTR) ; port OTR
VIN+: C24.2 R21.1 U1.46(VIN+)
VIN-: C24.1 R22.1 U1.47(VIN-)
VREF: C21.1 C35.1 U1.37(VREF)
NetAI_1: AI.1(X) R35.1
NetC2_1: C2.1 U1.48(VR)
NetC20_1: C20.1 C32.1 C33.2 U1.41(REFT) U1.42(REFT)
NetC20_2: C20.2 C33.1 C34.1 U1.39(REFB) U1.40(REFB)
NetC46_1: C46.1 R23.2
NetC49_1: C49.1 R25.2
NetC60_1: C60.1 R30.1 U3.3(/D) U3.4(VBB)
NetC61_2: C61.2 R39.2 R43.2 R44.2
NetR10_2: R10.2 U1.9(OEB)
NetR12_2: R12.2 R14.1 U21.3(+IN)
NetR21_2: R21.2 R36.1 TPIN+.1 U2.5(OUT-)
NetR22_2: R22.2 R37.2 TPIN-.1 U2.4(OUT+)
NetR23_1: R23.1 R25.1 U3.6(/Q) U3.7(Q) U21.1(OUT_A) U21.4(-IN)
NetR34_2: R34.2 R37.1 U2.1(IN-)
NetR35_2: R35.2 R36.2 U2.8(IN+)
NetR38_1: R38.1 R39.1 U3.2(D)

Not connected (* = marked no-connect by the designer): U1 8(NIC) 44(NIC); U2 7(NC)*

### Channels
AD9244A: designators AI=AI_2 C2=C2_1 C5=C5_2 C6=C6_2 C10=C10_1 C11=C11_1 C14=C14_1 C15=C15_1 C16=C16_1 C17=C17_1 C18=C18_1 C20=C20_1 C21=C21_1 C22=C22_1 C23=C23_1 C24=C24_1 C30=C30_1 C32=C32_1 C33=C33_1 C34=C34_1 C35=C35_1 C36=C36_1 C38=C38_1 C39=C39_1 C46=C46_1 C47=C47_1 C48=C48_1 C49=C49_1 C50=C50_1 C60=C60_1 C61=C61_1 C69=C69_1 C70=C70_2 C71=C71_1 R10=R10_1 R11=R11_1 R12=R12_1 R14=R14_1 R21=R21_1 R22=R22_1 R23=R23_1 R25=R25_1 R30=R30_1 R34=R34_1 R35=R35_1 R36=R36_1 R37=R37_1 R38=R38_1 R39=R39_1 R43=R43_1 R44=R44_1 TPIN+=TPIN+_1 TPIN-=TPIN-_1 U1=U1_1 U2=U2_1 U3=U3_1 U21=U21_1; ports ADCCLK=ADC1_CLK D0=ADC1_D1 D1=ADC1_D2 D2=ADC1_D3 D3=ADC1_D4 D4=ADC1_D5 D5=ADC1_D6 D6=ADC1_D7 D7=ADC1_D8 D8=ADC1_D9 D9=ADC1_D10 D10=ADC1_D11 D11=ADC1_D12 D12=ADC1_D13 D13=ADC1_D14 OTR=ADC1_OTR
AD9244B: designators AI=AI_1 C2=C2_2 C5=C5_1 C6=C6_1 C10=C10_2 C11=C11_2 C14=C14_2 C15=C15_2 C16=C16_2 C17=C17_2 C18=C18_2 C20=C20_2 C21=C21_2 C22=C22_2 C23=C23_2 C24=C24_2 C30=C30_2 C32=C32_2 C33=C33_2 C34=C34_2 C35=C35_2 C36=C36_2 C38=C38_2 C39=C39_2 C46=C46_2 C47=C47_2 C48=C48_2 C49=C49_2 C50=C50_2 C60=C60_2 C61=C61_2 C69=C69_2 C70=C70_1 C71=C71_2 R10=R10_2 R11=R11_2 R12=R12_2 R14=R14_2 R21=R21_2 R22=R22_2 R23=R23_2 R25=R25_2 R30=R30_2 R34=R34_2 R35=R35_2 R36=R36_2 R37=R37_2 R38=R38_2 R39=R39_2 R43=R43_2 R44=R44_2 TPIN+=TPIN+_2 TPIN-=TPIN-_2 U1=U1_2 U2=U2_2 U3=U3_2 U21=U21_2; ports ADCCLK=ADC2_CLK D0=ADC2_D1 D1=ADC2_D2 D2=ADC2_D3 D3=ADC2_D4 D4=ADC2_D5 D5=ADC2_D6 D6=ADC2_D7 D7=ADC2_D8 D8=ADC2_D9 D9=ADC2_D10 D10=ADC2_D11 D11=ADC2_D12 D12=ADC2_D13 D13=ADC2_D14 OTR=ADC2_OTR

### Notes on the sheet
- ADC
- (near C22) Internal Reference Vp-p(2V)
- ADC_CLK
- 方案1：pin2接FPGA输出的clk；
- 方案2：Pin2接Pin3,并接Pin1，由外部晶振产生时钟
- Pin1最终将时钟信号输出到IO
- 实际使用1.87K
- 靠近ADC输入端
- 实际使用510R和51R电阻
- 输入信号单端转差分
- 生成差分时钟

### Library data of the parts
AI = BNC: BNC Elbow Connector; LatestRevisionDate: 17-Jul-2002; LatestRevisionNote: Re-released for DXP Platform.; Publisher: Altium Limited
C2 C5 C10 C14 C16-C18 C24 C30 C32-C36 C38 C39 C46 C48-C50 C60 C61 C69 C70 = Cap Semi: Capacitor (Semiconductor SIM Model); Published: 8-Jun-2000; LatestRevisionDate: 29-May-2009; LatestRevisionNote: IPC-7351 Footprint Added.; PackageReference: C1206; Publisher: Altium Limited; PackageDescription: Chip Capacitor
  C2 C5 C10 C14 C16 C17 C30 C32-C36 C38 C46 C48-C50 C61 C69 C70: Value: 100nF
  C18: Value: 1nF
  C24: Value: 22pF
  C60: Value: 10nF
C6 C20-C23 = Cap Pol3: Polarized Capacitor (Surface Mount); Published: 8-Jun-2000; LatestRevisionDate: 29-May-2009; LatestRevisionNote: IPC-7351 Footprint Added.; PackageReference: C0805; Publisher: Altium Limited; PackageDescription: Chip Capacitor
C11 C15 C47 C71 = Cap Pol2: Polarized Capacitor (Axial); Published: 8-Jun-2000; LatestRevisionDate: 17-Jul-2002; LatestRevisionNote: Re-released for DXP Platform.; PackageReference: POLAR0.8; Publisher: Altium Limited; Value: 10uF
R10 R11 R21 R22 R30 R38 R39 R43 R44 = Res1: Resistor; Published: 8-Jun-2000; LatestRevisionDate: 17-Jul-2002; LatestRevisionNote: Re-released for DXP Platform.; PackageReference: AXIAL-0.3; Publisher: Altium Limited
  R10: Value: 1K
  R11 R21 R22: Value: 49.9
  R30 R38: Value: 10k
  R43: Value: 7.87k
  R44: Value: 1.86k
R12 R14 R23 R25 R34-R37 = Res1: Resistor; Value: 10k; Published: 8-Jun-2000; LatestRevisionDate: 17-Jul-2002; LatestRevisionNote: Re-released for DXP Platform.; PackageReference: AXIAL-0.3; Publisher: Altium Limited
TPIN+ TPIN- = Socket: LatestRevisionDate: 17-Jul-2002; LatestRevisionNote: Re-released for DXP Platform.; Publisher: Altium Limited
U1 = DSx4
U21 = AD8601: as U12 on sheet FPGA

## Nets that join several sheets
3V3: FPGA (57 pins), AD9244A (7 pins), AD9244B (7 pins)
+5V: FPGA (36 pins), AD9244A (24 pins), AD9244B (24 pins)
-5V: FPGA (11 pins), AD9244A (C70_2.2 C71_1.2 U2_1.6), AD9244B (C70_1.2 C71_2.2 U2_2.6)
AGND: FPGA (45 pins), AD9244A (41 pins), AD9244B (41 pins)
DGND: FPGA (71 pins), AD9244A (7 pins), AD9244B (7 pins)
ADC1_CLK: FPGA (XC6SLX9-144.137), AD9244A (C61_1.1 R11_1.2)
ADC1_D1: FPGA (XC6SLX9-144.134), AD9244A (U1_1.10)
ADC1_D2: FPGA (XC6SLX9-144.133), AD9244A (U1_1.11)
ADC1_D3: FPGA (XC6SLX9-144.132), AD9244A (U1_1.12)
ADC1_D4: FPGA (XC6SLX9-144.131), AD9244A (U1_1.13)
ADC1_D5: FPGA (XC6SLX9-144.127), AD9244A (U1_1.16)
ADC1_D6: FPGA (XC6SLX9-144.126), AD9244A (U1_1.17)
ADC1_D7: FPGA (XC6SLX9-144.124), AD9244A (U1_1.18)
ADC1_D8: FPGA (XC6SLX9-144.123), AD9244A (U1_1.19)
ADC1_D9: FPGA (XC6SLX9-144.121), AD9244A (U1_1.20)
ADC1_D10: FPGA (XC6SLX9-144.120), AD9244A (U1_1.21)
ADC1_D11: FPGA (XC6SLX9-144.119), AD9244A (U1_1.24)
ADC1_D12: FPGA (XC6SLX9-144.118), AD9244A (U1_1.25)
ADC1_D13: FPGA (XC6SLX9-144.117), AD9244A (U1_1.26)
ADC1_D14: FPGA (XC6SLX9-144.116), AD9244A (U1_1.27)
ADC1_OTR: FPGA (XC6SLX9-144.115), AD9244A (U1_1.28)
ADC2_CLK: FPGA (XC6SLX9-144.138), AD9244B (C61_2.1 R11_2.2)
ADC2_D1: FPGA (XC6SLX9-144.11), AD9244B (U1_2.10)
ADC2_D2: FPGA (XC6SLX9-144.10), AD9244B (U1_2.11)
ADC2_D3: FPGA (XC6SLX9-144.9), AD9244B (U1_2.12)
ADC2_D4: FPGA (XC6SLX9-144.8), AD9244B (U1_2.13)
ADC2_D5: FPGA (XC6SLX9-144.7), AD9244B (U1_2.16)
ADC2_D6: FPGA (XC6SLX9-144.6), AD9244B (U1_2.17)
ADC2_D7: FPGA (XC6SLX9-144.5), AD9244B (U1_2.18)
ADC2_D8: FPGA (XC6SLX9-144.2), AD9244B (U1_2.19)
ADC2_D9: FPGA (XC6SLX9-144.1), AD9244B (U1_2.20)
ADC2_D10: FPGA (XC6SLX9-144.144), AD9244B (U1_2.21)
ADC2_D11: FPGA (XC6SLX9-144.143), AD9244B (U1_2.24)
ADC2_D12: FPGA (XC6SLX9-144.142), AD9244B (U1_2.25)
ADC2_D13: FPGA (XC6SLX9-144.141), AD9244B (U1_2.26)
ADC2_D14: FPGA (XC6SLX9-144.140), AD9244B (U1_2.27)
ADC2_OTR: FPGA (XC6SLX9-144.139), AD9244B (U1_2.28)